# Altium project PCB_Project.PrjPcb
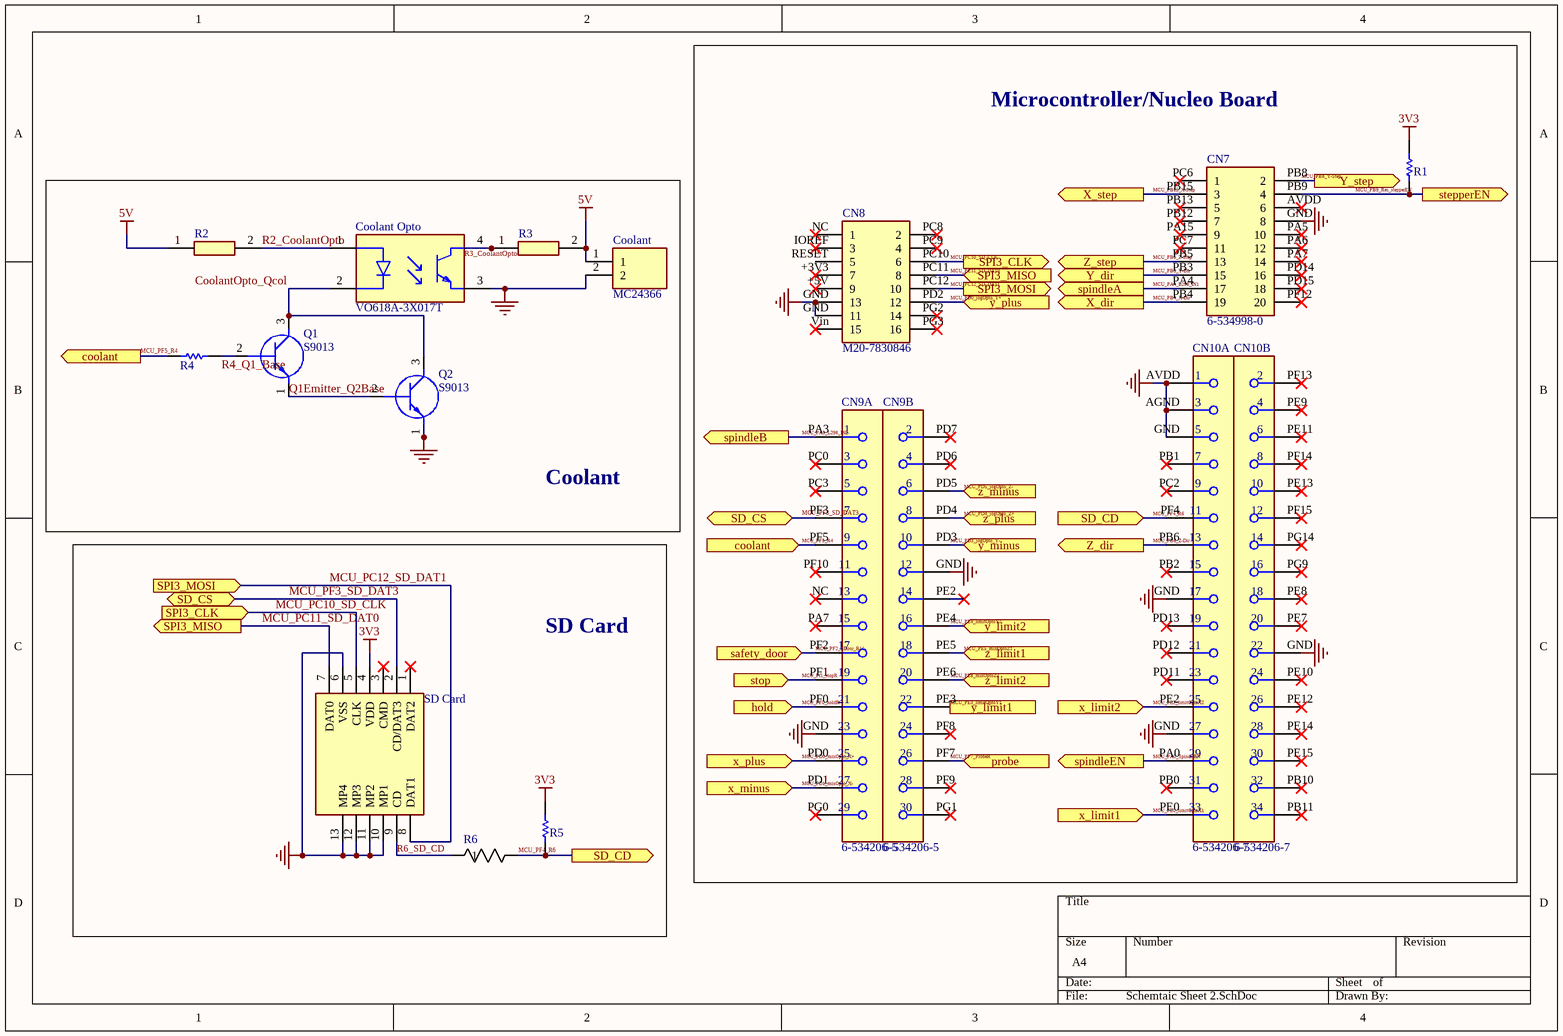
[diagram p0: Schemtaic Sheet 2.SchDoc]
3 sheets, 137 parts. Net scope: flat (ports and power ports of the same name join across sheets).
Board file: PCB.PcbDoc
Sheets:
  Schemtaic Sheet 2.SchDoc
  Schemtaic Sheet 4.SchDoc
  Schemtaic Sheet 3.SchDoc

## Sheet Schemtaic Sheet 2.SchDoc
size A4; SheetNumber: 1; SheetTotal: 3

### Parts
CN7  6-534998-0  [RHDR20W77P254X254_2X10_2540X503X673P]
CN8  M20-7830846  [RHDR16W70P254_2X8_2072X504X865P]
CN9  6-534206-5  [FP-6-534206-5-MFG]  (parts A,B of 2)
CN10  6-534206-7  [FP-6-534206-7-MFG]  (parts A,B of 2)
Coolant  MC24366  [Model Name]
Coolant_Opto  VO618A-3X017T  [FP-VO618A-3X017T-MFG]
Q1  S9013  [MJE13001TP]
Q2  S9013  [MJE13001TP]
R1  MFR-25FBF5210K  [RESA60-630X240]  (value not drawn)
R2  KNP100JB-73-75R  [RESAD2990W85L1150D460]  (value not drawn)
R3  MBB02070C9109FCT00  [RESAD1650W63L650D250]  (value not drawn)
R4  MFR-25FBF5210K  [RESA60-630X240]  (value not drawn)
R5  MFR-25FBF5210K  [RESA60-630X240]  (value not drawn)
R6  AC01000004700JA100  [RES_AC01_VIS]  (value not drawn)
SD_Card  MEM2075-00-140-01-A  [MEM20750014001A]  (value not drawn)

### Blocks framed on the sheet
Microcontroller/Nucleo Board: CN7-CN10 R1
Coolant: Coolant Coolant_Opto Q1 Q2 R2-R4
SD Card: R5 R6 SD_Card

### Ports
coolant (in, see Schemtaic Sheet 2[1B]), coolant (out, see Schemtaic Sheet 2[2C]), hold (in, see Schemtaic Sheet 4[3C]), probe (in, see Schemtaic Sheet 4[4A]), safety_door (in, see Schemtaic Sheet 4[3C]), SD_CD (in, see Schemtaic Sheet 2[2D]), SD_CD (out, see Schemtaic Sheet 2[3C]), SD_CS (bidir, see Schemtaic Sheet 2[1C]), SD_CS (bidir, see Schemtaic Sheet 2[2C]), SPI3_CLK (in, see Schemtaic Sheet 2[3B]), SPI3_CLK (out, see Schemtaic Sheet 2[1C]), SPI3_MISO (in, see Schemtaic Sheet 2[1C]), SPI3_MISO (out, see Schemtaic Sheet 2[3B]), SPI3_MOSI (in, see Schemtaic Sheet 2[3B]), SPI3_MOSI (out, see Schemtaic Sheet 2[1C]), spindleA (out, see Schemtaic Sheet 4[2C]), spindleB (out, see Schemtaic Sheet 4[2C]), spindleEN (out, see Schemtaic Sheet 4[2C]), stepperEN (out, see Schemtaic Sheet 4[1C], Schemtaic Sheet 4[2C]), stop (in, see Schemtaic Sheet 4[3B]), X_dir (out, see Schemtaic Sheet 4[1C]), x_limit1 (in, see Schemtaic Sheet 3[1D]), x_limit2 (in, see Schemtaic Sheet 3[1D]), x_minus (in, see Schemtaic Sheet 3[3D]), x_plus (in, see Schemtaic Sheet 3[3D]), X_step (out, see Schemtaic Sheet 4[1C]), Y_dir (out, see Schemtaic Sheet 4[1D]), y_limit1 (in, see Schemtaic Sheet 3[1D]), y_limit2 (in, see Schemtaic Sheet 3[1D]), y_minus (in, see Schemtaic Sheet 3[4D]), y_plus (in, see Schemtaic Sheet 3[4D]), Y_step (out, see Schemtaic Sheet 4[1D]), Z_dir (out, see Schemtaic Sheet 4[2C]), z_limit1 (in, see Schemtaic Sheet 3[3D]), z_limit2 (in, see Schemtaic Sheet 3[3D]), z_minus (in, see Schemtaic Sheet 3[4C]), z_plus (in, see Schemtaic Sheet 3[4D]), Z_step (out, see Schemtaic Sheet 4[2C])

### Nets
3V3: R1.2 R5.2 SD_Card.4(VDD)
5V: Coolant.1 R2.1 R3.2
GND: CN7.GND(8) CN8.GND(13) CN9.GND CN10.AGND CN10.AVDD CN10.GND Coolant.2 Coolant_Opto.3(E) Q2.1(E) SD_Card.6(VSS) SD_Card.10(MP1) SD_Card.11(MP2) SD_Card.12(MP3) SD_Card.13(MP4)
CoolantOpto_Qcol: Coolant_Opto.2(C) Q1.3(C) Q2.3(C)
MCU_PA0_SpindleEN: CN10.PA0 ; port spindleEN
MCU_PA3_L298_IN2: CN9.PA3 ; port spindleB
MCU_PA4_L298_IN1: CN7.PA4(17) ; port spindleA
MCU_PB3_Y-Dir: CN7.PB3(15) ; port Y_dir
MCU_PB4_X-Dir: CN7.PB4(19) ; port X_dir
MCU_PB5_Z-Step: CN7.PB5(13) ; port Z_step
MCU_PB6_Z-Dir: CN10.PB6 ; port Z_dir
MCU_PB8_Y-Step: CN7.PB8(2) ; port Y_step
MCU_PB9_Res_stepperEN: CN7.PB9(4) R1.1 ; port stepperEN
MCU_PB15_X-Step: CN7.PB15(3) ; port X_step
MCU_PC10_SD_CLK: CN8.PC10(6) SD_Card.5(CLK) ; port SPI3_CLK
MCU_PC11_SD_DAT0: CN8.PC11(8) SD_Card.7(DAT0) ; port SPI3_MISO
MCU_PC12_SD_DAT1: CN8.PC12(10) SD_Card.8(DAT1) ; port SPI3_MOSI
MCU_PD0_jogOpto_Y+: CN8.PD2(12) ; port y_plus
MCU_PD0_mixOpto_X+: CN9.PD0 ; port x_plus
MCU_PD1_mixOpto_X-: CN9.PD1 ; port x_minus
MCU_PD3_jogOpto_Y-: CN9.PD3 ; port y_minus
MCU_PD4_jogOpto_Z+: CN9.PD4 ; port z_plus  [project net MCU_PD3_jogOpto_Z+]
MCU_PD5_jogOpto_Z-: CN9.PD5 ; port z_minus  [project net MCU_PD0_jogOpto_Z-]
MCU_PE0_limitOptoX1: CN10.PE0 ; port x_limit1
MCU_PE2_limitOptoX2: CN10.PE2 ; port x_limit2
MCU_PE3_limitOptoY1: CN9.PE3 ; port y_limit1  [project net MCU_PE2_limitOptoY1]
MCU_PE4_limitOptoY2: CN9.PE4 ; port y_limit2  [project net MCU_PE0_limitOptoY2]
MCU_PE5_mixOptoZ1: CN9.PE5 ; port z_limit1  [project net MCU_PD1_mixOpto_Z1]
MCU_PE8_mixOptoZ2: CN9.PE6 ; port z_limit2  [project net MCU_PD0_mixOpto_Z2]
MCU_PF0_holdR: CN9.PF0 ; port hold
MCU_Pf1_stopR: CN9.PF1 ; port stop
MCU_PF2_SDoor_R11: CN9.PF2 ; port safety_door
MCU_PF3_SD_DAT3: CN9.PF3 SD_Card.2(CD/DAT3) ; port SD_CS
MCU_PF4_R6: CN10.PF4 R5.1 R6.2 ; port SD_CD
MCU_PF5_R4: CN9.PF5 R4.1 ; port coolant
MCU_PF7_ProbeR: CN9.PF7 ; port probe
Q1Emitter_Q2Base: Q1.1(E) Q2.2(B)
R2_CoolantOpto: Coolant_Opto.1(A) R2.2
R3_CoolantOpto: Coolant_Opto.4(C) R3.1
R4_Q1_Base: Q1.2(B) R4.2
R6_SD_CD: R6.1 SD_Card.9(CD)

Not connected (* = marked no-connect by the designer): CN7 AVDD(6)* PA5(10)* PA6(12)* PA7(14)* PA15(9)* PB12(7)* PB13(5)* PC6(1)* PC7(11)* PD14(16)* PD15(18)* PF12(20)*; CN8 +3V3(7)* +5V(9)* IOREF(3)* NC(1)* PC8(2)* PC9(4)* PG2(14)* PG3(16)* RESET(5) Vin(15)*; CN9 NC(13)* PA7(15)* PC0(3)* PC3(5)* PD6(4)* PD7(2)* PE2(14)* PF8(24)* PF9(28)* PF10(11)* PG0(29)* PG1(30)*; CN10 PB0(31)* PB1(7)* PB2(15)* PB10(32)* PB11(34)* PC2(9)* PD11(23)* PD12(21)* PD13(19)* PE7(20)* PE8(18)* PE9(4)* PE10(24)* PE11(6)* PE12(26)* PE13(10)* PE14(28)* PE15(30)* PF13(2)* PF14(8)* PF15(12)* PG9(16)* PG14(14)*; SD_Card 1(DAT2)* 3(CMD)*

### Library data of the parts
CN7 = 6-534998-0: Connector; Manufacturer_Name: TE Connectivity; Datasheet Link: http://www.te.com/commerce/DocumentDelivery/DDEController?Action=showdoc&DocId=Catalog+Section%7F1307819_SECTION_5%7F0908%7Fpdf%7FEnglish%7FENG_CS_1307819_SECTION_5_0908.pdf%7F6-534998-0; Height: 6.73mm; Manufacturer_Part_Number: 6-534998-0; Mouser Part Number: 571-6-534998-0; Mouser Price/Stock: https://www.mouser.co.uk/ProductDetail/TE-Connectivity/6-534998-0?qs=xDp7PGUNC%252BtlNIlh1MxdbQ%3D%3D; Arrow Part Number: 6-534998-0; Arrow Price/Stock: https://www.arrow.com/en/products/6-534998-0/te-connectivity
CN8 = M20-7830846: Connector; Manufacturer_Name: Harwin; Datasheet Link: https://cdn.harwin.com/pdfs/M20-783.pdf; Height: 8.65mm; Manufacturer_Part_Number: M20-7830846; Mouser Part Number: 855-M20-7830846; Mouser Price/Stock: https://www.mouser.co.uk/ProductDetail/Harwin/M20-7830846?qs=vF78I%252BjhbY9RWFQV7oNW%252BQ%3D%3D
CN9 = CMP-03369-000056-1: CONN RCPT 30POS 0.1 GOLD PCB; Manufacturer: TE; Number Of Contacts: 30; Is Female: yes; Pitch: 2.54mm; Conn Gender: Female; Standoff Height: 0.38mm; Conn Orientation: Vertical; Current Rating: 2A; Lead Free: Yes; Category: Conn; Mouser Description: Headers & Wire Housings REC 2X15P VRT T/H; Device Class L3: unset; Height: 8.9mm; ComponentLink2Description: Datasheet; Manufacturer Part Number: 6-534206-5; RoHS: TRUE; ComponentLink2URL: https://www.te.com/commerce/DocumentDelivery/DDEController?Action=showdoc&DocId=Specification+Or+Standard%7F114-25018%7FE%7Fpdf%7FEnglish%7FENG_SS_114-25018_E.pdf%7F6-534206-5; Temperature: -65°C to +105°C; Temperature Range Low: -65°C; Footprint Url: https://www.te.com/commerce/DocumentDelivery/DDEController?Action=showdoc&DocId=Customer+Drawing%7F534206%7FR7%7Fpdf%7FEnglish%7FENG_CD_534206_R7.pdf%7F6-534206-5; Contact Material: Gold,Nickel; Automotive: No; Package: 0; Device Class L2: Headers and Wire Housings; Device Class L1: Connectors; Temperature Range High: +105°C; Number Of Rows: 2; Digikey Description: CONN RCPT 30POS 0.1 GOLD PCB; Octopart: https://octopart.com/6-534206-5-te+connectivity-39516817
CN10 = CMP-03369-000075-1: CONN RCPT 34POS 0.1 GOLD PCB; Manufacturer: TE Connectivity; Pitch: 2.54mm; Number Of Contacts: 34; Standoff Height: 0.38mm; Conn Gender: Female; Conn Orientation: Vertical; Is Female: yes; Current Rating: 2A; Voltage Rating: 333V; Number Of Rows: 2; RoHS: TRUE; Lead Free: Yes; Contact Material: Gold,Nickel; Device Class L3: unset; Octopart: https://octopart.com/6-534206-7-te+connectivity-39516825; Automotive: No; Mouser Description: Headers & Wire Housings REC 2X17P VRT T/H; Temperature Range Low: -65°C; Device Class L1: Connectors; Footprint Url: https://www.te.com/commerce/DocumentDelivery/DDEController?Action=showdoc&DocId=Customer+Drawing%7F534206%7FR7%7Fpdf%7FEnglish%7FENG_CD_534206_R7.pdf%7F6-534206-7; ComponentLink2URL: https://www.te.com/commerce/DocumentDelivery/DDEController?Action=showdoc&DocId=Specification+Or+Standard%7F114-25018%7FE%7Fpdf%7FEnglish%7FENG_SS_114-25018_E.pdf%7F6-534206-7; Temperature: -65°C to +105°C; Device Class L2: Headers and Wire Housings; Height: 8.9mm; Temperature Range High: +105°C; Digikey Description: CONN RCPT 34POS 0.1 GOLD PCB; Manufacturer Part Number: 6-534206-7; Category: Conn; Package: 6-534206-7; ComponentLink2Description: Datasheet
Coolant = MC24366: TERMINAL BLOCK, WIRE TO BRD, 2POS, 12AWG; Manufacturer_Name: MULTICOMP; Geometry.Height: 14.3mm; Manufacturer_Part_Number: MC24366; Mouser Part Number: *; Mouser Price/Stock: *; Arrow Part Number: *; Arrow Price/Stock: *; Datasheet Link: *
Coolant_Opto = CMP-02521-000022-1: OPTOISOLATOR 5.3KV TRANS 4-SMD; Max Power Dissipation: 150mW; Collector-emitter Voltage-Max: 400mV; Number of Elements: 1; Forward Voltage: 1.1V; Max Collector Current: 50mA; Collector Emitter Voltage (VCEO): 80V; Current Transfer Ratio: 100%; Forward Current: 60mA; Reverse Breakdown Voltage: 6V; Input Type: DC; Series: -; Mount: Surface Mount; Isolation Voltage: 5.3kV; Contact Plating: Tin; Max Output Voltage: 80V; Package Quantity: 1; RoHS Compliant: Yes; Min Operating Temperature: -55°C; Power Dissipation: 150mW; Max Operating Temperature: 110°C; Radiation Hardening: No; Packaging: Tape and Reel; Max Input Current: 60mA; Output Current per Channel: 50mA; Number of Pins: 4; Case/Package: SMD/SMT; Number of Channels: 1; Lead Free: Lead Free; Collector Emitter Saturation Voltage: 400mV; Input Current: 60mA
Q1 Q2 = S9013: Transistor BJT NPN; Manufacturer_Name: MCC; Datasheet Link: https://datasheet.datasheetarchive.com/originals/distributors/Datasheets-19/DSA-361984.pdf; Height: 6.5mm; Manufacturer_Part_Number: S9013
R1 R4 R5 = CMP-1659-00074-2: Axial Resistor, 10 KOhm, +/- 1%, 0.25 W, -55 to 155 degC, 2-Pin THD, RoHS, Bulk; Manufacturer: Yageo; Temperature Coefficient: 100ppm\/degreesC; Voltage Rating: 250V; Voltage Rating (DC): 200V; Resistance: 10KOhm; Max Power Dissipation: 250mW; Datasheet URL: http://www.yageo.com/documents/recent/Yageo%20LR_MFR_2013.pdf; Packaging: Bulk; RoHSCompliant: True; Mount: ThroughHole; Package Reference: MFR-25; Termination: Axial; Composition: MetalFilm; Number of Terminations: 2; Package Quantity: 200; Mounting Technology: ThroughHole; Length: 0.248inch; Max Operating Temperature: 155degC; Min Operating Temperature: -55degC; Datasheet Version: 04/2013; Lead Free: LeadFree; Manufacturer URL: http://www.yageo.com/; Tolerance: 1%; Power Rating: 250mW; Package Description: 2-Pin Axial Lead, Dia 2.4 mm, Body Length 6.3 mm; Military Standard: Not; Case\/Package: Axial
R2 = KNP100JB-73-75R: Resistor; Manufacturer_Name: YAGEO; Datasheet Link: https://www.arrow.com/en/products/knp100jb-73-75r/yageo?region=nac; Manufacturer_Part_Number: KNP100JB-73-75R
R3 = MBB02070C9109FCT00: Resistor; Manufacturer_Name: Vishay; Datasheet Link: https://www.vishay.com/docs/28766/mbxsma.pdf; Manufacturer_Part_Number: MBB02070C9109FCT00
R6 = CMP-00030-42521877-1: AC01000004700JA100 VISHAY AC01000004700JA100 Through Hole Resistor, 470 ohm, Axial Leaded, 1 W, 5%, AC Series; Temperature Coefficient: 180ppm/°C; Voltage Rating (DC): 22V; Max Power Dissipation: 1W; Resistance: 470Ω; Lead Diameter: 800µm; Max Operating Temperature: 200°C; Number of Pins: 2; Weight: 519.986953mg; Contact Plating: Tin; Radiation Hardening: No; Number of Terminations: 2; Military Standard: Not; REACH SVHC: Unknown; Packaging: Cut Tape (CT); Tolerance: 5%; Composition: Wirewound; NexarPartId: 42521877; Case/Package: Conformal; Termination: Axial; Power Rating: 1W; RoHS: Compliant; Length: 11mm; Min Operating Temperature: 0°C; Diameter: 4.3mm
SD_Card = MEM2075-00-140-01-A: Connector; Manufacturer_Name: GCT (GLOBAL CONNECTOR TECHNOLOGY); Datasheet Link: http://www.farnell.com/cad/2606866.pdf; Manufacturer_Part_Number: MEM2075-00-140-01-A; Mouser Part Number: 640-MEM20750014001A; Mouser Price/Stock: https://www.mouser.co.uk/ProductDetail/GCT/MEM2075-00-140-01-A?qs=KUoIvG%2F9IlZvfWpeERlq3Q%3D%3D

## Sheet Schemtaic Sheet 4.SchDoc
size A4; SheetNumber: 2; SheetTotal: 3
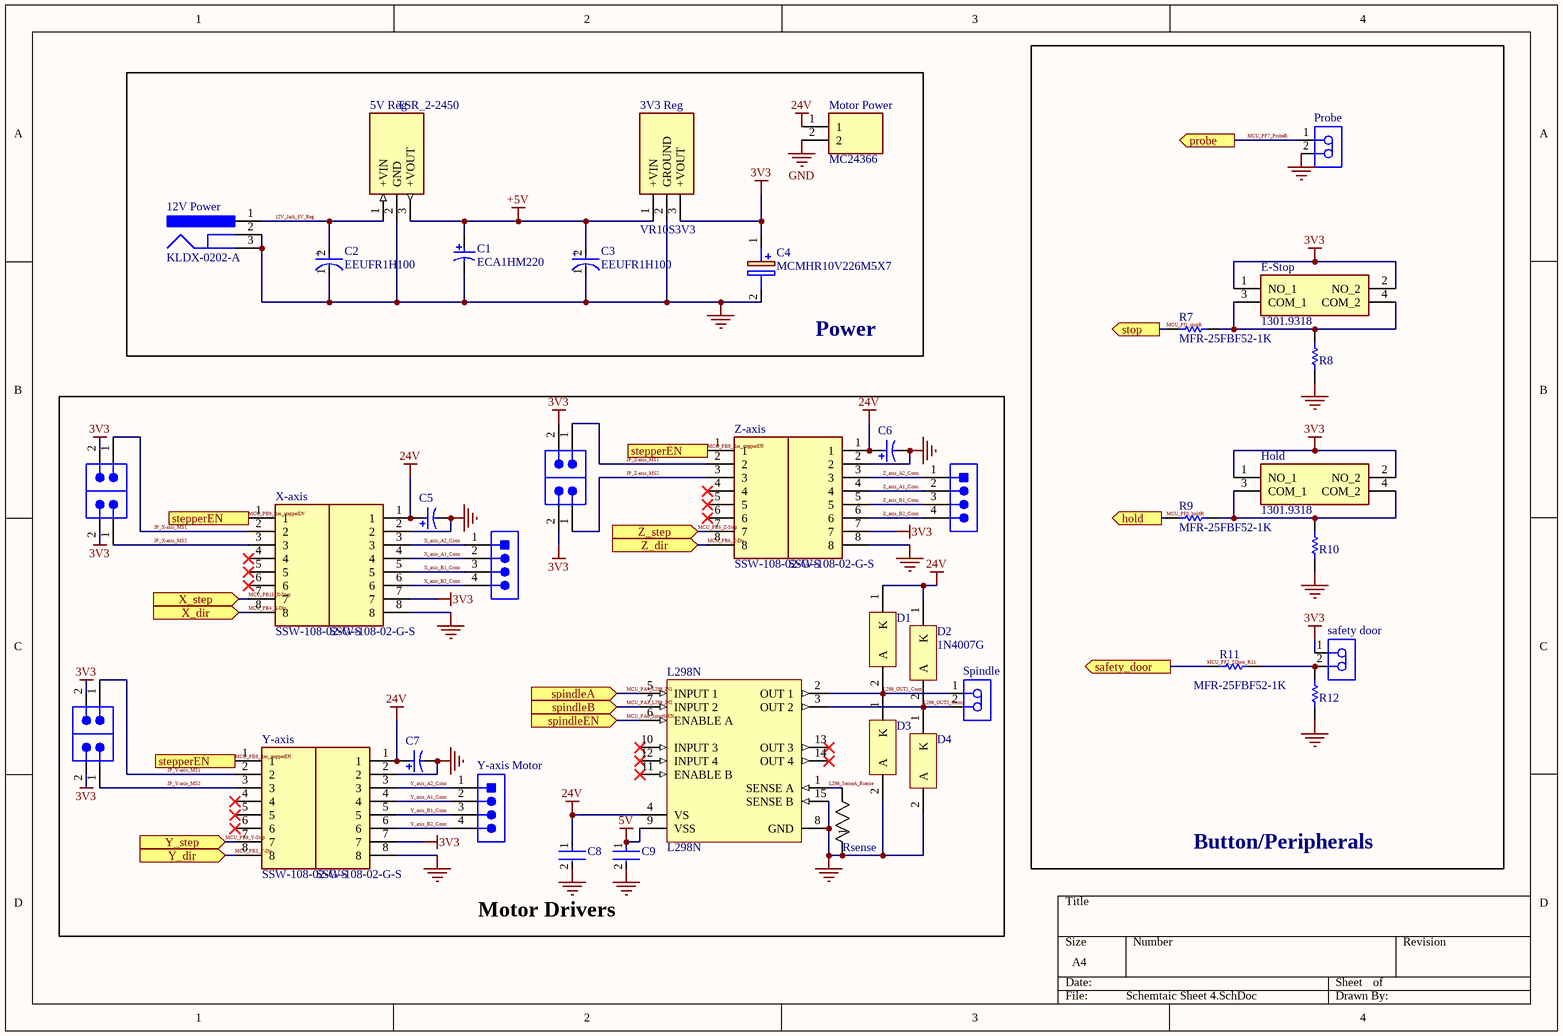
[diagram p1: Schemtaic Sheet 4.SchDoc]

### Parts
3V3_Reg  VR10S3V3  [VR10S3V3]
5V_Reg  TSR_2-2450  [TSR-2]
12V_Power  KLDX-0202-A  [KYCN-KLDX-0202-A_V]
C1  ECA1HM220  [CAPPR55-200-1100X500X1200]
C2  EEUFR1H100  [FP-RAD-TH-D_5_0_5-L_11_1-MFG]
C3  EEUFR1H100  [FP-RAD-TH-D_5_0_5-L_11_1-MFG]
C4  MCMHR10V226M5X7  [CAPPRD200W47D525H800]
C5  ECA1HM101  [CAPPR65-350-1150X800X1250]  (value not drawn)
C6  ECA1HM101  [CAPPR65-350-1150X800X1250]  (value not drawn)
C7  ECA1HM101  [CAPPR65-350-1150X800X1250]  (value not drawn)
C8  K104K15X7RF5TH5  [FP-K15H5-MFG]  (value not drawn)
C9  K104K15X7RF5TH5  [FP-K15H5-MFG]  (value not drawn)
D1  1N4007G  [ONSC-AXIAL_LEAD-2-59-10_P]  (value not drawn)
D2  1N4007G  [ONSC-AXIAL_LEAD-2-59-10_P]
D3  1N4007G  [ONSC-AXIAL_LEAD-2-59-10_P]  (value not drawn)
D4  1N4007G  [ONSC-AXIAL_LEAD-2-59-10_P]  (value not drawn)
E-Stop  1301.9318  [13019318]
Hold  1301.9318  [13019318]
L298N  L298N  [STM-FM-15]
Motor_Power  MC24366  [MC24366]
Probe  B2B-PH-K-S(LF)(SN)  [JST-B2B-PH-K-S_V]  (value not drawn)
R7  MFR-25FBF52-1K  [RESA60-630X240]
R8  MFR-25FBF5210K  [RESA60-630X240]  (value not drawn)
R9  MFR-25FBF52-1K  [RESA60-630X240]
R10  MFR-25FBF5210K  [RESA60-630X240]  (value not drawn)
R11  MFR-25FBF52-1K  [RESA60-630X240]
R12  MFR-25FBF5210K  [RESA60-630X240]  (value not drawn)
Rsense  AC05000001508JAC00  [RES_AC05_VIS]  (value not drawn)
safety_door  B2B-PH-K-S(LF)(SN)  [JST-B2B-PH-K-S_V]  (value not drawn)
Spindle  B2B-PH-K-S(LF)(SN)  [JST-B2B-PH-K-S_V]  (value not drawn)
X-axis  SSW-108-02-G-S  [RHDR8W79P0X254_1X8_2083X241X851P]
X-axis_Header_R  SSW-108-02-G-S  [RHDR8W79P0X254_1X8_2083X241X851P]
X-axis_Motor  B4B-EH-A(LF)(SN)  [JST-B4B-EH-A_V]  (value not drawn)
X-MS1  61300211121  [61300211121]  (value not drawn)
X-MS2  61300211121  [61300211121]  (value not drawn)
Y-axis  SSW-108-02-G-S  [RHDR8W79P0X254_1X8_2083X241X851P]
Y-axis_Header_R  SSW-108-02-G-S  [RHDR8W79P0X254_1X8_2083X241X851P]
Y-axis_Motor  B4B-EH-A(LF)(SN)  [JST-B4B-EH-A_V]  (value not drawn)
Y-MS1  61300211121  [61300211121]  (value not drawn)
Y-MS2  61300211121  [61300211121]  (value not drawn)
Z-axis  SSW-108-02-G-S  [RHDR8W79P0X254_1X8_2083X241X851P]
Z-axis_Header_R  SSW-108-02-G-S  [RHDR8W79P0X254_1X8_2083X241X851P]
Z-axis_Motor  B4B-EH-A(LF)(SN)  [JST-B4B-EH-A_V]  (value not drawn)
Z-MS1  61300211121  [61300211121]  (value not drawn)
Z-MS2  61300211121  [61300211121]  (value not drawn)

### Blocks framed on the sheet
Power: 3V3_Reg 5V_Reg 12V_Power C1-C4 Motor_Power
Button/Peripherals: E-Stop Hold Probe R7-R12 safety_door

### Ports
hold (out, see Schemtaic Sheet 2[2C]), probe (out, see Schemtaic Sheet 2[3C]), safety_door (out, see Schemtaic Sheet 2[2C]), spindleA (in, see Schemtaic Sheet 2[3B]), spindleB (in, see Schemtaic Sheet 2[2B]), spindleEN (in, see Schemtaic Sheet 2[3C]), stepperEN (out, see Schemtaic Sheet 2[4A], Schemtaic Sheet 4[1C]), stepperEN (out, see Schemtaic Sheet 2[4A], Schemtaic Sheet 4[1C], Schemtaic Sheet 4[2B]), stop (out, see Schemtaic Sheet 2[2C]), X_dir (in, see Schemtaic Sheet 2[3B]), X_step (in, see Schemtaic Sheet 2[3A]), Y_dir (in, see Schemtaic Sheet 2[3B]), Y_step (in, see Schemtaic Sheet 2[4A]), Z_dir (in, see Schemtaic Sheet 2[3C]), Z_step (in, see Schemtaic Sheet 2[3B])

### Nets
3V3: 3V3_Reg.3(+VOUT) C4.1(+) E-Stop.1(NO_1) E-Stop.2(NO_2) Hold.1(NO_1) Hold.2(NO_2) safety_door.1 X-axis_Header_R.7 X-MS1.2 X-MS2.2 Y-axis_Header_R.7 Y-MS1.2 Y-MS2.2 Z-axis_Header_R.7 Z-MS1.2 Z-MS2.2
5V: C9.1 L298N.9(VSS)
24V: C5.1 C6.1 C7.1 C8.1 D1.1(K) D2.1(K) L298N.4(VS) Motor_Power.1 X-axis_Header_R.1 Y-axis_Header_R.1 Z-axis_Header_R.1
+5V: 3V3_Reg.1(+VIN) 5V_Reg.3(+VOUT) C1.1 C3.2(A)
GND: 3V3_Reg.2(GROUND) 5V_Reg.2(GND) 12V_Power.2 12V_Power.3 C1.2 C2.1(C) C3.1(C) C4.2(-) C5.2 C6.2 C7.2 C8.2 C9.2 D3.2(A) D4.2(A) L298N.8(GND) L298N.15(SENSE_B) Motor_Power.2 Probe.2 R8.1 R10.1 R12.1 Rsense.1 X-axis_Header_R.2 X-axis_Header_R.8 Y-axis_Header_R.2 Y-axis_Header_R.8 Z-axis_Header_R.2 Z-axis_Header_R.8
12V_Jack_5V_Reg: 5V_Reg.1(+VIN) 12V_Power.1 C2.2(A)
JP_X-axis_MS1: X-axis.2 X-MS1.1
JP_X-axis_MS2: X-axis.3 X-MS2.1
JP_Y-axis_MS1: Y-axis.2 Y-MS1.1
JP_Y-axis_MS2: Y-axis.3 Y-MS2.1
JP_Z-axis_MS1: Z-axis.2 Z-MS1.1
JP_Z-axis_MS2: Z-axis.3 Z-MS2.1
L298_OUT1_Conn: D1.2(A) D3.1(K) L298N.2(OUT_1) Spindle.1
L298_OUT2_Conn: D2.2(A) D4.1(K) L298N.3(OUT_2) Spindle.2
L298_SenseA_Rsense: L298N.1(SENSE_A) Rsense.2
MCU_PA0_SpindleEN: L298N.6(ENABLE_A) ; port spindleEN
MCU_PA3_L298_IN2: L298N.7(INPUT_2) ; port spindleB
MCU_PA4_L298_IN1: L298N.5(INPUT_1) ; port spindleA
MCU_PB3_Y-Dir: Y-axis.8 ; port Y_dir
MCU_PB4_X-Dir: X-axis.8 ; port X_dir
MCU_PB5_Z-Step: Z-axis.7 ; port Z_step
MCU_PB6_Z-Dir: Z-axis.8 ; port Z_dir
MCU_PB8_Y-Step: Y-axis.7 ; port Y_step
MCU_PB9_Res_stepperEN: X-axis.1 Y-axis.1 Z-axis.1 ; port stepperEN
MCU_PB15_X-Step: X-axis.7 ; port X_step
MCU_PF0_holdR: R9.1 ; port hold
MCU_Pf1_stopR: R7.1 ; port stop
MCU_PF2_SDoor_R11: R11.1 ; port safety_door
MCU_PF7_ProbeR: Probe.1 ; port probe
X_axis_A1_Conn: X-axis_Header_R.4 X-axis_Motor.2
X_axis_A2_Conn: X-axis_Header_R.3 X-axis_Motor.1
X_axis_B1_Conn: X-axis_Header_R.5 X-axis_Motor.3
X_axis_B2_Conn: X-axis_Header_R.6 X-axis_Motor.4
Y_axis_A1_Conn: Y-axis_Header_R.4 Y-axis_Motor.2
Y_axis_A2_Conn: Y-axis_Header_R.3 Y-axis_Motor.1
Y_axis_B1_Conn: Y-axis_Header_R.5 Y-axis_Motor.3
Y_axis_B2_Conn: Y-axis_Header_R.6 Y-axis_Motor.4
Z_axis_A1_Conn: Z-axis_Header_R.4 Z-axis_Motor.2
Z_axis_A2_Conn: Z-axis_Header_R.3 Z-axis_Motor.1
Z_axis_B1_Conn: Z-axis_Header_R.5 Z-axis_Motor.3
Z_axis_B2_Conn: Z-axis_Header_R.6 Z-axis_Motor.4
NetE-Stop_3: E-Stop.3(COM_1) E-Stop.4(COM_2) R7.2 R8.2
NetHold_3: Hold.3(COM_1) Hold.4(COM_2) R9.2 R10.2
NetR11_2: R11.2 R12.2 safety_door.2

Not connected (* = marked no-connect by the designer): L298N 10(INPUT_3)* 11(ENABLE_B)* 12(INPUT_4)* 13(OUT_3)* 14(OUT_4)*; X-axis 4* 5* 6*; Y-axis 4* 5* 6*; Z-axis 4* 5* 6*

### Notes on the sheet
- Motor Drivers
- (in symbol CMP-05427-001295-1) +

### Library data of the parts
3V3_Reg = VR10S3V3: Power Supply; Manufacturer_Name: XP POWER; Datasheet Link: https://www.xppower.com/portals/0/pdfs/SF_VR10.pdf; Height: 10.9mm; Manufacturer_Part_Number: VR10S3V3; Mouser Part Number: 209-VR10S3V3; Mouser Price/Stock: https://www.mouser.co.uk/ProductDetail/XP-Power/VR10S3V3?qs=7MVldsJ5UazpqISEyvrTNQ%3D%3D
5V_Reg = TSR_2-2450: Power Supply; Manufacturer_Name: Traco Power; Manufacturer_Part_Number: TSR 2-2450; Datasheet Link: https://tracopower.com/tsr2-datasheet/; Mouser Part Number: 495-TSR2-2450; Mouser Price/Stock: https://www.mouser.co.uk/ProductDetail/TRACO-Power/TSR-2-2450?qs=NtE2QagKf6RzknAolzm%2FTQ%3D%3D; Arrow Part Number: TSR 2-2450; Arrow Price/Stock: https://www.arrow.com/en/products/tsr2-2450/traco-electronic-ag?region=europe
12V_Power = CMP-1673-00001-5: DC Power Jack, 24 V, 3.5 A, -25 to 85 degC, 3-Pin THD, RoHS; Manufacturer: Kycon; Voltage Rating: 24 V; Current Rating: 3.5 A; Height: 10.8 mm; Length: 9.2 mm; Pins: 2; Housing Material: PBT; Connector Type: Power; ComponentLink2URL: http://www.kycon.com/Pub_Eng_Draw/KLDX-0202-X.PDF; PackageDescription: 3-Pin Through Hole Device, Body 14.5 x 9 mm; Max Operating Temperature: 85 degC; Min Operating Temperature: -25 degC; PackageReference: KLDX-0202-A; Contact Gender: Female; Package Quantity: 500; Mount: Through Hole; Colour: Black; Contact Plating: Tin; DatasheetVersion: Rev. D3, 06/2013; ComponentLink2Description: Datasheet; RoHSCompliant: true; Mounting Technology: Through Hole; ComponentLink1Description: Manufacturer URL; Contact Material: Brass; ComponentLink1URL: http://www.kycon.com/
C1 = CMP-1665-00036-2: Aluminum Electrolytic Capacitor, 22 uF, +/- 20%, 50 V, -40 to 85 degC, 2-Pin THD, RoHS, Bulk; Manufacturer: Panasonic; Ripple Current: 100mA; Life (Hours): 2000Hour; Voltage: 50V; Dissipation Factor: 0.12%; Leakage Current: 3uA; Lead/Base Style: Straight; Capacitance: 22uF; Lead Diameter: 0.5mm; Max Operating Temperature: 85degC; Height: 11mm; Package Reference: CAPPR55-200-1100X500X1200; Radiation Hardening: No; RoHSCompliant: true; Termination: Radial; Case/Package: Radial; REACH SVHC: NoSVHC; Height - Seated (Max): 0.472inch; Min Operating Temperature: -40degC; Packaging: Bulk; Manufacturer URL: http://www.panasonic.com/; Length: 11mm; Tolerance: 20%; Voltage Rating: 50V; Voltage Rating (DC): 50V; Datasheet URL: https://industrial.panasonic.com/cdbs/www-data/pdf/RDF0000/ABA0000C1218.pdf; Lead Pitch: 2mm; Ripple Current (AC): 100mA; Package Description: 2-Pin Radial Lead, Dia 5 mm, Height 12 mm; Diameter: 5mm; Datasheet Version: Rev. 05, 10/2016; Package Quantity: 200; Mount: ThroughHole
C2 C3 = CMP-05427-001295-1: Aluminum Electrolytic Capacitors (Radial Lead Type) 10uF ±20% 50V; Lead Diameter: 0.5mm; Life (Hours): 5000Hour; Impedance: 340mR; Ripple Current (AC): 250mA; REACH SVHC: Yes; Tolerance: 20%; Construction: RADIAL; Min Operating Temperature: -40°C; Termination: Radial; Voltage Rating: 50V; Height: 11mm; Max Operating Temperature: 105°C; Capacitance: 10uF; Voltage: 50V; Diameter: 5mm; Lead Pitch: 2mm; Series: FR Radial; RoHS Compliant: Yes; Case/Package: Radial
C4 = MCMHR10V226M5X7: Capacitor Polarised; Manufacturer_Name: Multicomp Pro; Datasheet Link: https://componentsearchengine.com/Datasheets/2/MCMHR10V226M5X7.pdf; Height: 8mm; Manufacturer_Part_Number: MCMHR10V226M5X7
C5-C7 = CMP-1665-00042-2: Aluminum Electrolytic Capacitor, 100 uF, +/- 20%, 50 V, -40 to 85 degC, 2-Pin THD, RoHS, Bulk; Manufacturer: Panasonic; Lead Diameter: 0.6mm; Dielectric Material: Aluminium; Voltage Rating (DC): 50V; Ripple Current (AC): 250mA; Polarity: Polar; Leakage Current: 3uA; Capacitance: 100uF; Life (Hours): 2000Hour; Lead/Base Style: Straight; Dissipation Factor: 0.12%; Radiation Hardening: No; Height: 11.5mm; Package Quantity: 200; Package Reference: CAPPR65-350-1150X800X1250; Min Operating Temperature: -40degC; Mount: ThroughHole; Package Description: 2-Pin Radial Lead, Dia 8 mm, Height 12.5 mm; Case/Package: Radial; Diameter: 8mm; Voltage Rating: 50V; Length: 11.5mm; REACH SVHC: NoSVHC; Height - Seated (Max): 0.492inch; Datasheet URL: https://industrial.panasonic.com/cdbs/www-data/pdf/RDF0000/ABA0000C1218.pdf; RoHSCompliant: true; Ripple Current: 250mA; Lead Free: LeadFree; Voltage: 50V; Manufacturer URL: http://www.panasonic.com/; Number of Pins: 2; Datasheet Version: Rev. 05, 10/2016; Packaging: Bulk; Termination: Radial; Max Operating Temperature: 85degC; Tolerance: 20%; Lead Pitch: 3.5mm
C8 C9 = CMP-02417-000078-1: CAP CER 0.1UF 50V X7R RADIAL; Capacitance: 100nF; Tolerance: 10%; Dielectric Material: Ceramic; Lead Length: 30mm; Lead Diameter: 0.5mm; Lead/Base Style: Formed Leads; Diameter: 500um; Max Operating Temperature: 125°C; Case/Package: Dipped; Dielectric: X7R; Lead Free: Lead Free; Construction: RADIAL; Voltage: 50V; Thickness: 2.6mm; Min Operating Temperature: -55°C; Lead Pitch: 5mm; Height: 4mm; Radiation Hardening: No; Voltage Rating: 50V; Depth: 2.5mm; Voltage Rating (DC): 50V; Package Quantity: 1; Weight: 0.005644oz; Series: K; Mount: Through Hole; Termination: Radial; Height - Seated (Max): 0.257inch; Length: 4mm; Packaging: Tape and Reel; Width: 2.5mm; RoHS Compliant: Yes
D1-D4 = CMP-0902-00143-1: Standard Recovery Rectifier, 2-Pin Axial_Lead, Pb-Free, Bulk Bag; Manufacturer: On Semiconductor; VRRM Max (V): 1000; IFSM Max (A): 30; IO(rec) Max (A): 1; ComponentLink2Description: Datasheet; ComponentLink2URL: http://www.onsemi.com/pub_link/Collateral/1N4001-D.PDF; PackageDescription: 2-Pin, Axial Lead, Diameter 2.35 mm; PartNumber: 1N4007G; ComponentLink1URL: http://www.onsemi.com/; ComponentLink3URL: http://www.onsemi.cn/pub_link/Collateral/59-10.PDF; PackageReference: AXIAL_LEAD-2-59-10; ComponentLink1Description: Manufacturer URL; Mounting Technology: Through Hole; ComponentLink3Description: Package Specification; Packing: Bulk Bag; PackageVersion: Rev. U, 02/2005; DatasheetVersion: Rev. 13; RoHS: TRUE; Type: Standard Recovery
E-Stop Hold = 1301.9318: IP40 Black Button Tactile Switch, SPST-NO 4.4mm; Manufacturer_Name: SCHURTER; Geometry.Height: 8mm; Manufacturer_Part_Number: 1301.9318; Mouser Part Number: 693-1301.9318; Mouser Price/Stock: https://www.mouser.co.uk/ProductDetail/Schurter/13019318?qs=tGaZrb6HVSaxYojxkk2y5w%3D%3D; Arrow Part Number: *; Arrow Price/Stock: *; Datasheet Link: https://componentsearchengine.com/Datasheets/2/1301.9318.pdf
L298N = CMP-2000-06526-1: Dual Full-Bridge Driver, 4.8 to 46 V, -40 to 150 degC, 15-Pin FM (MW 15L), RoHS, Tube; Manufacturer: STMicroelectronics; PartNumber: L298; Output Current: 2A; Supply Voltage Max: 7V; Driver Case Style: Multiwatt; Supply Voltage Min: 4.5V; No. of Pins: 15Pins; SVHC: NoSVHC(17-Dec-2015); Output Voltage: 46V; No. of Outputs: 4Outputs; Motor Type: FullBridge; MSL: -; Package Description: 15-Pin Flange Mount, Body 5 x 19.6 mm, Pitch 1.27 mm; Datasheet Version: 01/2000; Package Reference: FM-15; Mounting Technology: ThroughHole; Packaging: Each; Automotive Qualification Standard: -; Product Range: -; Datasheet URL: https://datasheet.ciiva.com/15109/getdatasheetpartid-50682-15109332.pdf; Operating Temperature Max: 130°C; Operating Temperature Min: -25°C; Manufacturer URL: http://www.st.com/
Motor_Power = MC24366: as Coolant on sheet Schemtaic Sheet 2; Manufacturer_Part_Number: MC24366; Mouser Part Number: *; Mouser Price/Stock: *; Arrow Part Number: *; Arrow Price/Stock: *; Datasheet Link: *
Probe safety_door Spindle = CMP-2000-05162-1: Male Header, Pitch 2 mm, 1 x 2 Position, Height 6 mm, Tail Length 3.4 mm, -25 to 85 degC, RoHS, Bulk; Manufacturer: JST; Pitch: 2mm; Style/Orientation: StraightHeader/Plug; No of Positions: 2; Datasheet Version: Nov-08; Datasheet URL: http://datasheet.octopart.com/B2B-PH-K-S%28LF%29%28SN%29-JST-datasheet-8324864.pdf; Manufacturer URL: http://www.jst.com/home2.html; Type: ShroudedHeader; Termination: Crimp
R7 R9 R11 = CMP-1659-00075-1: Axial Resistor, 1 KOhm, +/- 1%, 250 mW, -55 to 155 degC, 2-Pin THD, RoHS, Bulk; Voltage Rating: 250 V; Resistance: 10 kohm; Power Rating: 250 mW; ComponentLink2Description: Datasheet; RoHSCompliant: true; PackageReference: MFR-25; Case\Package: Axial; Max Operating Temperature: 155 degC; DatasheetVersion: Apr-13; Tolerance: 1%; ComponentLink1URL: http://www.yageo.com/; Length: 0.248 inch; ComponentLink2URL: http://www.yageo.com/documents/recent/Yageo%20LR_MFR_2013.pdf; Packaging: Bulk; Package Quantity: 200; PackageDescription: 2-Pin Axial Lead, Dia 2.4 mm, Body Length 6.3 mm; Min Operating Temperature: -55 degC; ComponentLink1Description: Manufacturer URL
R8 R10 R12 = CMP-1659-00074-2: as R1 on sheet Schemtaic Sheet 2; Datasheet URL: http://www.yageo.com/documents/recent/Yageo%20LR_MFR_2013.pdf; Packaging: Bulk; RoHSCompliant: True; Mount: ThroughHole; Package Reference: MFR-25; Termination: Axial; Composition: MetalFilm; Number of Terminations: 2; Package Quantity: 200; Mounting Technology: ThroughHole; Length: 0.248inch; Max Operating Temperature: 155degC; Min Operating Temperature: -55degC; Datasheet Version: 04/2013; Lead Free: LeadFree; Manufacturer URL: http://www.yageo.com/; Tolerance: 1%; Power Rating: 250mW; Package Description: 2-Pin Axial Lead, Dia 2.4 mm, Body Length 6.3 mm; Military Standard: Not; Case\/Package: Axial
Rsense = CMP-00030-39746773-1: AC05000001508JAC00 Resistor, 1.5 Ohm, ± 5%, 5 W, Axial Leaded, Wirewound, General Purpose; Voltage Rating: 3V; Power Rating: 5W; Resistance: 1.5Ω; Lead Diameter: 800µm; Temperature Coefficient: -80ppm/°C; RoHS: Compliant; Weight: 1.900013g; Voltage Rating (DC): 3V; Max Operating Temperature: 275°C; NexarPartId: 39746773; Features: Flame Retardant Coating; Number of Pins: 2; REACH SVHC: Unknown; Contact Plating: Tin; Min Operating Temperature: -40°C; Width: 7.493mm; Radiation Hardening: No; Number of Terminations: 2; Diameter: 7.5mm; Termination: Axial; Composition: Wirewound; Max Power Dissipation: 5W; Packaging: Tape & Box (TB); Length: 18mm; Tolerance: 5%; Case/Package: Axial; Military Standard: Not
X-axis X-axis_Header_R Y-axis Y-axis_Header_R Z-axis Z-axis_Header_R = SSW-108-02-G-S: Connector; Manufacturer_Name: SAMTEC; Datasheet Link: https://componentsearchengine.com/Datasheets/1/SSW-108-02-G-S-LL.pdf; Height: 8.51mm; Manufacturer_Part_Number: SSW-108-02-G-S; Mouser Part Number: 200-SSW10802GS; Mouser Price/Stock: https://www.mouser.co.uk/ProductDetail/Samtec/SSW-108-02-G-S?qs=rU5fayqh%252BE1JXJ1Fey24nA%3D%3D; Arrow Part Number: SSW-108-02-G-S; Arrow Price/Stock: https://www.arrow.com/en/products/ssw-108-02-g-s/samtec?region=nac
X-axis_Motor Y-axis_Motor Z-axis_Motor = CMP-2000-05904-1: Male Header, Pitch 2.5 mm, 1 x 4 Position, Height 6 mm, Tail Length 3.2 mm, -25 to 85 degC, RoHS, Bulk; Manufacturer: JST; Style/Orientation: StraightHeader/Plug; Pitch: 2.5mm; No of Positions: 4; Mounting Technology: SurfaceMount; Package Description: Male Header, Pitch 2.5 mm, 1 x 4 Position, Height 6 mm, Tail Length 3.2 mm; Datasheet Version: 12/2012; Type: ShroudedHeader; Package Reference: B4B-EH-A; Manufacturer URL: http://www.jst.com/home2.html; Termination: Crimp; Datasheet URL: http://www.jst-mfg.com/product/pdf/eng/eEH.pdf
X-MS1 X-MS2 Y-MS1 Y-MS2 Z-MS1 Z-MS2 = CMP-1712-00002-5: NexarPartId: 20081794; Operating Supply Voltage: 250V; Current Rating: 3A; Gender: Male; Number of Contacts: 2; Pitch: 2.54mm; Connector Type: Male Pin; Contact Resistance: 20mΩ; Contact Plating: Gold; Contact Material: Copper; Number of Pins: 2; Min Operating Temperature: -40°C; Packaging: Bulk; Lead Pitch: 2.54mm; Mount: Through Hole; Orientation: Vertical; RoHS: Compliant; REACH SVHC: No SVHC; Height: 8.94mm; Termination: Through Hole; Number of Positions: 2; Contact Mating Length: 5.9944mm; Color: Black; Contact Gender: Male; Number of Rows: 1; Housing Material: PBT; Lead Free: Lead Free; Voltage Rating: 250V; Max Operating Temperature: 125°C

## Sheet Schemtaic Sheet 3.SchDoc
size A4; SheetNumber: 3; SheetTotal: 3
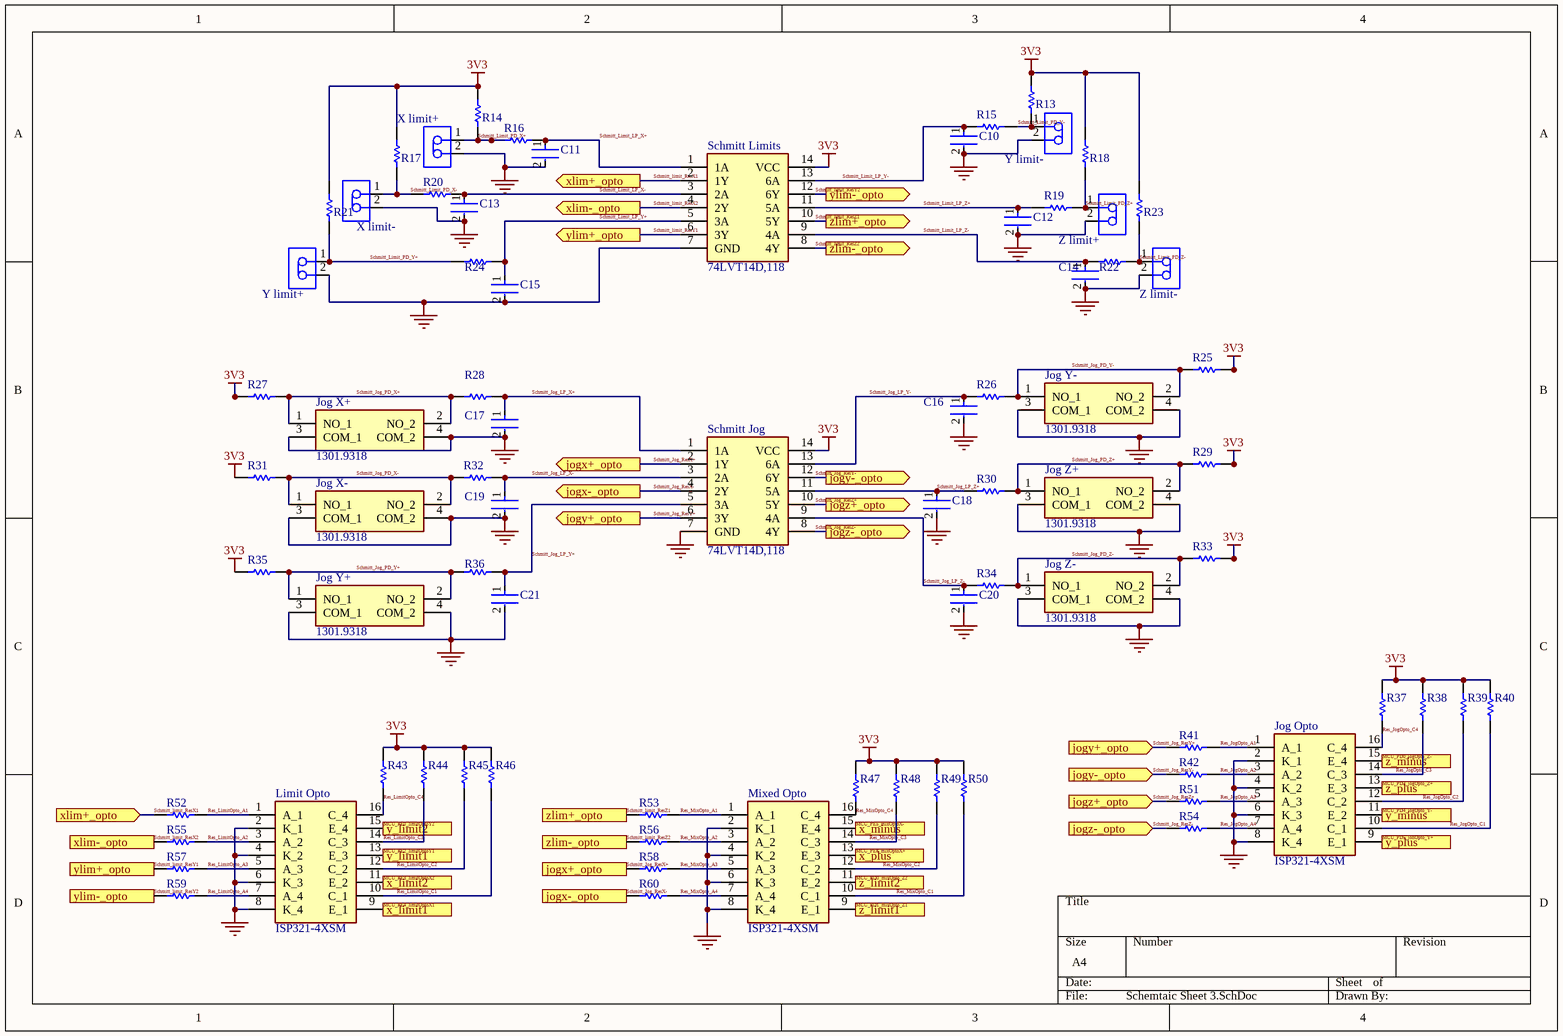
[diagram p2: Schemtaic Sheet 3.SchDoc]

### Parts
C10  K104K15X7RF5TH5  [FP-K15H5-MFG]  (value not drawn)
C11  K104K15X7RF5TH5  [FP-K15H5-MFG]  (value not drawn)
C12  K104K15X7RF5TH5  [FP-K15H5-MFG]  (value not drawn)
C13  K104K15X7RF5TH5  [FP-K15H5-MFG]  (value not drawn)
C14  K104K15X7RF5TH5  [FP-K15H5-MFG]  (value not drawn)
C15  K104K15X7RF5TH5  [FP-K15H5-MFG]  (value not drawn)
C16  K104K15X7RF5TH5  [FP-K15H5-MFG]  (value not drawn)
C17  K104K15X7RF5TH5  [FP-K15H5-MFG]  (value not drawn)
C18  K104K15X7RF5TH5  [FP-K15H5-MFG]  (value not drawn)
C19  K104K15X7RF5TH5  [FP-K15H5-MFG]  (value not drawn)
C20  K104K15X7RF5TH5  [FP-K15H5-MFG]  (value not drawn)
C21  K104K15X7RF5TH5  [FP-K15H5-MFG]  (value not drawn)
Jog_Opto  ISP321-4XSM  [SOP254P1016X460-16N]
Jog_X+  1301.9318  [13019318]
Jog_X-  1301.9318  [Model Name]
Jog_Y+  1301.9318  [13019318]
Jog_Y-  1301.9318  [13019318]
Jog_Z+  1301.9318  [13019318]
Jog_Z-  1301.9318  [13019318]
Limit_Opto  ISP321-4XSM  [SOP254P1016X460-16N]
Mixed_Opto  ISP321-4XSM  [SOP254P1016X460-16N]
R13  MFR-25FBF5210K  [RESA60-630X240]  (value not drawn)
R14  MFR-25FBF5210K  [RESA60-630X240]  (value not drawn)
R15  MFR-25FBF52-1K  [RESA60-630X240]  (value not drawn)
R16  MFR-25FBF52-1K  [RESA60-630X240]  (value not drawn)
R17  MFR-25FBF5210K  [RESA60-630X240]  (value not drawn)
R18  MFR-25FBF5210K  [RESA60-630X240]  (value not drawn)
R19  MFR-25FBF52-1K  [RESA60-630X240]  (value not drawn)
R20  MFR-25FBF52-1K  [RESA60-630X240]  (value not drawn)
R21  MFR-25FBF5210K  [RESA60-630X240]  (value not drawn)
R22  MFR-25FBF52-1K  [RESA60-630X240]  (value not drawn)
R23  MFR-25FBF5210K  [RESA60-630X240]  (value not drawn)
R24  MFR-25FBF52-1K  [RESA60-630X240]  (value not drawn)
R25  MFR-25FBF5210K  [RESA60-630X240]  (value not drawn)
R26  MFR-25FBF52-1K  [RESA60-630X240]  (value not drawn)
R27  MFR-25FBF5210K  [RESA60-630X240]  (value not drawn)
R28  MFR-25FBF52-1K  [RESA60-630X240]  (value not drawn)
R29  MFR-25FBF5210K  [RESA60-630X240]  (value not drawn)
R30  MFR-25FBF52-1K  [RESA60-630X240]  (value not drawn)
R31  MFR-25FBF5210K  [RESA60-630X240]  (value not drawn)
R32  MFR-25FBF52-1K  [RESA60-630X240]  (value not drawn)
R33  MFR-25FBF5210K  [RESA60-630X240]  (value not drawn)
R34  MFR-25FBF52-1K  [RESA60-630X240]  (value not drawn)
R35  MFR-25FBF5210K  [RESA60-630X240]  (value not drawn)
R36  MFR-25FBF52-1K  [RESA60-630X240]  (value not drawn)
R37  MFR-25FBF52-1K  [RESA60-630X240]  (value not drawn)
R38  MFR-25FBF52-1K  [RESA60-630X240]  (value not drawn)
R39  MFR-25FBF52-1K  [RESA60-630X240]  (value not drawn)
R40  MFR-25FBF52-1K  [RESA60-630X240]  (value not drawn)
R41  MFR-25FBF52-1K  [RESA60-630X240]  (value not drawn)
R42  MFR-25FBF52-1K  [RESA60-630X240]  (value not drawn)
R43  MFR-25FBF52-1K  [RESA60-630X240]  (value not drawn)
R44  MFR-25FBF52-1K  [RESA60-630X240]  (value not drawn)
R45  MFR-25FBF52-1K  [RESA60-630X240]  (value not drawn)
R46  MFR-25FBF52-1K  [RESA60-630X240]  (value not drawn)
R47  MFR-25FBF52-1K  [RESA60-630X240]  (value not drawn)
R48  MFR-25FBF52-1K  [RESA60-630X240]  (value not drawn)
R49  MFR-25FBF52-1K  [RESA60-630X240]  (value not drawn)
R50  MFR-25FBF52-1K  [RESA60-630X240]  (value not drawn)
R51  MFR-25FBF52-1K  [RESA60-630X240]  (value not drawn)
R52  MFR-25FBF52-1K  [RESA60-630X240]  (value not drawn)
R53  MFR-25FBF52-1K  [RESA60-630X240]  (value not drawn)
R54  MFR-25FBF52-1K  [RESA60-630X240]  (value not drawn)
R55  MFR-25FBF52-1K  [RESA60-630X240]  (value not drawn)
R56  MFR-25FBF52-1K  [RESA60-630X240]  (value not drawn)
R57  MFR-25FBF52-1K  [RESA60-630X240]  (value not drawn)
R58  MFR-25FBF52-1K  [RESA60-630X240]  (value not drawn)
R59  MFR-25FBF52-1K  [RESA60-630X240]  (value not drawn)
R60  MFR-25FBF52-1K  [RESA60-630X240]  (value not drawn)
Schmitt_Jog  74LVT14D,118  [SOIC127P600X175-14N]
Schmitt_Limits  74LVT14D,118  [SOIC127P600X175-14N]
X_limit+  B2B-PH-K-S(LF)(SN)  [JST-B2B-PH-K-S_V]  (value not drawn)
X_limit-  B2B-PH-K-S(LF)(SN)  [JST-B2B-PH-K-S_V]  (value not drawn)
Y_limit+  B2B-PH-K-S(LF)(SN)  [JST-B2B-PH-K-S_V]  (value not drawn)
Y_limit-  B2B-PH-K-S(LF)(SN)  [JST-B2B-PH-K-S_V]  (value not drawn)
Z_limit+  B2B-PH-K-S(LF)(SN)  [JST-B2B-PH-K-S_V]  (value not drawn)
Z_limit-  B2B-PH-K-S(LF)(SN)  [JST-B2B-PH-K-S_V]  (value not drawn)

### Ports
jogx+_opto (in, see Schemtaic Sheet 3[2B]), jogx+_opto (out, see Schemtaic Sheet 3[2D]), jogx-_opto (in, see Schemtaic Sheet 3[2B]), jogx-_opto (out, see Schemtaic Sheet 3[2D]), jogy+_opto (in, see Schemtaic Sheet 3[2C]), jogy+_opto (out, see Schemtaic Sheet 3[3C]), jogy-_opto (in, see Schemtaic Sheet 3[3B]), jogy-_opto (out, see Schemtaic Sheet 3[3D]), jogz+_opto (in, see Schemtaic Sheet 3[3B]), jogz+_opto (out, see Schemtaic Sheet 3[3D]), jogz-_opto (in, see Schemtaic Sheet 3[3C]), jogz-_opto (out, see Schemtaic Sheet 3[3D]), x_limit1 (out, see Schemtaic Sheet 2[3D]), x_limit2 (out, see Schemtaic Sheet 2[3C]), x_minus (out, see Schemtaic Sheet 2[2D]), x_plus (out, see Schemtaic Sheet 2[2C]), xlim+_opto (in, see Schemtaic Sheet 3[2A]), xlim+_opto (out, see Schemtaic Sheet 3[1D]), xlim-_opto (in, see Schemtaic Sheet 3[2A]), xlim-_opto (out, see Schemtaic Sheet 3[1D]), y_limit1 (out, see Schemtaic Sheet 2[3C]), y_limit2 (out, see Schemtaic Sheet 2[3C]), y_minus (out, see Schemtaic Sheet 2[3C]), y_plus (out, see Schemtaic Sheet 2[3B]), ylim+_opto (in, see Schemtaic Sheet 3[2A]), ylim+_opto (out, see Schemtaic Sheet 3[1D]), ylim-_opto (in, see Schemtaic Sheet 3[3A]), ylim-_opto (out, see Schemtaic Sheet 3[1D]), z_limit1 (out, see Schemtaic Sheet 2[3C]), z_limit2 (out, see Schemtaic Sheet 2[3C]), z_minus (out, see Schemtaic Sheet 2[3B]), z_plus (out, see Schemtaic Sheet 2[3C]), zlim+_opto (in, see Schemtaic Sheet 3[3A]), zlim+_opto (out, see Schemtaic Sheet 3[2D]), zlim-_opto (in, see Schemtaic Sheet 3[3A]), zlim-_opto (out, see Schemtaic Sheet 3[2D])

### Nets
3V3: R13.2 R14.2 R17.2 R18.2 R21.2 R23.2 R25.2 R27.1 R29.2 R31.1 R33.2 R35.1 R37.2 R38.2 R39.2 R40.2 R43.2 R44.2 R45.2 R46.2 R47.2 R48.2 R49.2 R50.2 Schmitt_Jog.14(VCC) Schmitt_Limits.14(VCC)
GND: C10.2 C11.2 C12.2 C13.2 C14.2 C15.2 C16.2 C17.2 C18.2 C19.2 C20.2 C21.2 Jog_Opto.2(K_1) Jog_Opto.4(K_2) Jog_Opto.6(K_3) Jog_Opto.8(K_4) Jog_X+.3(COM_1) Jog_X+.4(COM_2) Jog_X-.3(COM_1) Jog_X-.4(COM_2) Jog_Y+.3(COM_1) Jog_Y+.4(COM_2) Jog_Y-.3(COM_1) Jog_Y-.4(COM_2) Jog_Z+.3(COM_1) Jog_Z+.4(COM_2) Jog_Z-.3(COM_1) Jog_Z-.4(COM_2) Limit_Opto.2(K_1) Limit_Opto.4(K_2) Limit_Opto.6(K_3) Limit_Opto.8(K_4) Mixed_Opto.2(K_1) Mixed_Opto.4(K_2) Mixed_Opto.6(K_3) Mixed_Opto.8(K_4) Schmitt_Jog.7(GND) Schmitt_Limits.7(GND) X_limit+.2 X_limit-.2 Y_limit+.2 Y_limit-.2 Z_limit+.2 Z_limit-.2
MCU_PD0_jogOpto_Z-: Jog_Opto.15(E_4) ; port z_minus
MCU_PD0_mixOpto_Z2: Mixed_Opto.11(E_2) ; port z_limit2
MCU_PD1_mixOpto_Z1: Mixed_Opto.9(E_1) ; port z_limit1
MCU_PD3_jogOpto_Z+: Jog_Opto.13(E_3) ; port z_plus
MCU_PD4_jogOpto_Y-: Jog_Opto.11(E_2) ; port y_minus  [project net MCU_PD3_jogOpto_Y-]
MCU_PD5_johOpto_Y+: Jog_Opto.9(E_1) ; port y_plus  [project net MCU_PD0_jogOpto_Y+]
MCU_PE0_limitOptoY2: Limit_Opto.15(E_4) ; port y_limit2
MCU_PE2_limitOptoY1: Limit_Opto.13(E_3) ; port y_limit1
MCU_PE3_limitOptoX2: Limit_Opto.11(E_2) ; port x_limit2  [project net MCU_PE2_limitOptoX2]
MCU_PE4_limitOptoX1: Limit_Opto.9(E_1) ; port x_limit1  [project net MCU_PE0_limitOptoX1]
MCU_PE5_mixOptoX-: Mixed_Opto.15(E_4) ; port x_minus  [project net MCU_PD1_mixOpto_X-]
MCU_PE8_mixOptoX+: Mixed_Opto.13(E_3) ; port x_plus  [project net MCU_PD0_mixOpto_X+]
Res_JogOpto_A1: Jog_Opto.1(A_1) R41.2
Res_JogOpto_A2: Jog_Opto.3(A_2) R42.2
Res_JogOpto_A3: Jog_Opto.5(A_3) R51.2
Res_JogOpto_A4: Jog_Opto.7(A_4) R54.2
Res_JogOpto_C1: Jog_Opto.10(C_1) R40.1
Res_JogOpto_C2: Jog_Opto.12(C_2) R39.1
Res_JogOpto_C3: Jog_Opto.14(C_3) R38.1
Res_JogOpto_C4: Jog_Opto.16(C_4) R37.1
Res_LimitOpto_A1: Limit_Opto.1(A_1) R52.2
Res_LimitOpto_A2: Limit_Opto.3(A_2) R55.2
Res_LimitOpto_A3: Limit_Opto.5(A_3) R57.2
Res_LimitOpto_A4: Limit_Opto.7(A_4) R59.2
Res_LimitOpto_C1: Limit_Opto.10(C_1) R46.1
Res_LimitOpto_C2: Limit_Opto.12(C_2) R45.1
Res_LimitOpto_C3: Limit_Opto.14(C_3) R44.1
Res_LimitOpto_C4: Limit_Opto.16(C_4) R43.1
Res_MixOpto_A1: Mixed_Opto.1(A_1) R53.2
Res_MixOpto_A2: Mixed_Opto.3(A_2) R56.2
Res_MixOpto_A3: Mixed_Opto.5(A_3) R58.2
Res_MixOpto_A4: Mixed_Opto.7(A_4) R60.2
Res_MixOpto_C1: Mixed_Opto.10(C_1) R50.1
Res_MixOpto_C2: Mixed_Opto.12(C_2) R49.1
Res_MixOpto_C3: Mixed_Opto.14(C_3) R48.1
Res_MixOpto_C4: Mixed_Opto.16(C_4) R47.1
Schmitt_Jog_LP_X+: C17.1 R28.2 Schmitt_Jog.1(1A)
Schmitt_Jog_LP_X-: C19.1 R32.2 Schmitt_Jog.3(2A)
Schmitt_Jog_LP_Y+: C21.1 R36.2 Schmitt_Jog.5(3A)
Schmitt_Jog_LP_Y-: C16.1 R26.1 Schmitt_Jog.13(6A)
Schmitt_Jog_LP_Z+: C18.1 R30.1 Schmitt_Jog.11(5A)
Schmitt_Jog_LP_Z-: C20.1 R34.1 Schmitt_Jog.9(4A)
Schmitt_Jog_PD_X+: Jog_X+.1(NO_1) Jog_X+.2(NO_2) R27.2 R28.1
Schmitt_Jog_PD_X-: Jog_X-.1(NO_1) Jog_X-.2(NO_2) R31.2 R32.1
Schmitt_Jog_PD_Y+: Jog_Y+.1(NO_1) Jog_Y+.2(NO_2) R35.2 R36.1
Schmitt_Jog_PD_Y-: Jog_Y-.1(NO_1) Jog_Y-.2(NO_2) R25.1 R26.2
Schmitt_Jog_PD_Z+: Jog_Z+.1(NO_1) Jog_Z+.2(NO_2) R29.1 R30.2
Schmitt_Jog_PD_Z-: Jog_Z-.1(NO_1) Jog_Z-.2(NO_2) R33.1 R34.2
Schmitt_Jog_ResX+: R58.1 Schmitt_Jog.2(1Y) ; port jogx+_opto
Schmitt_Jog_ResX-: R60.1 Schmitt_Jog.4(2Y) ; port jogx-_opto
Schmitt_Jog_ResY+: R41.1 Schmitt_Jog.6(3Y) ; port jogy+_opto
Schmitt_Jog_ResY-: R42.1 Schmitt_Jog.12(6Y) ; port jogy-_opto
Schmitt_Jog_ResZ+: R51.1 Schmitt_Jog.10(5Y) ; port jogz+_opto
Schmitt_Jog_ResZ-: R54.1 Schmitt_Jog.8(4Y) ; port jogz-_opto
Schmitt_Limit_LP_X+: C11.1 R16.2 Schmitt_Limits.1(1A)
Schmitt_Limit_LP_X-: C13.1 R20.2 Schmitt_Limits.3(2A)
Schmitt_Limit_LP_Y+: C15.1 R24.2 Schmitt_Limits.5(3A)
Schmitt_Limit_LP_Y-: C10.1 R15.1 Schmitt_Limits.13(6A)
Schmitt_Limit_LP_Z+: C12.1 R19.1 Schmitt_Limits.11(5A)
Schmitt_Limit_LP_Z-: C14.1 R22.1 Schmitt_Limits.9(4A)
Schmitt_Limit_PD_X+: R14.1 R16.1 X_limit+.1
Schmitt_Limit_PD_X-: R17.1 R20.1 X_limit-.1
Schmitt_Limit_PD_Y+: R21.1 R24.1 Y_limit+.1
Schmitt_Limit_PD_Y-: R13.1 R15.2 Y_limit-.1
Schmitt_Limit_PD_Z+: R18.1 R19.2 Z_limit+.1
Schmitt_Limit_PD_Z-: R22.2 R23.1 Z_limit-.1
Schmitt_limit_ResX1: R52.1 Schmitt_Limits.2(1Y) ; port xlim+_opto
Schmitt_limit_ResX2: R55.1 Schmitt_Limits.4(2Y) ; port xlim-_opto
Schmitt_limit_ResY1: R57.1 Schmitt_Limits.6(3Y) ; port ylim+_opto
Schmitt_limit_ResY2: R59.1 Schmitt_Limits.12(6Y) ; port ylim-_opto
Schmitt_limit_ResZ1: R53.1 Schmitt_Limits.10(5Y) ; port zlim+_opto
Schmitt_limit_ResZ2: R56.1 Schmitt_Limits.8(4Y) ; port zlim-_opto

### Library data of the parts
C10-C21 = CMP-02417-000078-1: as C8 on sheet Schemtaic Sheet 4; Diameter: 500um; Max Operating Temperature: 125°C; Case/Package: Dipped; Dielectric: X7R; Lead Free: Lead Free; Construction: RADIAL; Voltage: 50V; Thickness: 2.6mm; Min Operating Temperature: -55°C; Lead Pitch: 5mm; Height: 4mm; Radiation Hardening: No; Voltage Rating: 50V; Depth: 2.5mm; Voltage Rating (DC): 50V; Package Quantity: 1; Weight: 0.005644oz; Series: K; Mount: Through Hole; Termination: Radial; Height - Seated (Max): 0.257inch; Length: 4mm; Packaging: Tape and Reel; Width: 2.5mm; RoHS Compliant: Yes
Jog_Opto Limit_Opto Mixed_Opto = ISP321-4XSM: Phototransistor; Manufacturer_Name: Isocom; Datasheet Link: http://isocom.com/wp-content/uploads/2017/08/DD93207-ISP321-1-2-4_20_01_17.pdf; Height: 4.6mm; Manufacturer_Part_Number: ISP321-4XSM
Jog_X+ Jog_X- Jog_Y+ Jog_Y- Jog_Z+ Jog_Z- = 1301.9318: as E-Stop on sheet Schemtaic Sheet 4; Manufacturer_Part_Number: 1301.9318; Mouser Part Number: 693-1301.9318; Mouser Price/Stock: https://www.mouser.co.uk/ProductDetail/Schurter/13019318?qs=tGaZrb6HVSaxYojxkk2y5w%3D%3D; Arrow Part Number: *; Arrow Price/Stock: *; Datasheet Link: https://componentsearchengine.com/Datasheets/2/1301.9318.pdf
R13 R14 R17 R18 R21 R23 R25 R27 R29 R31 R33 R35 = CMP-1659-00074-2: as R1 on sheet Schemtaic Sheet 2; Datasheet URL: http://www.yageo.com/documents/recent/Yageo%20LR_MFR_2013.pdf; Packaging: Bulk; RoHSCompliant: True; Mount: ThroughHole; Package Reference: MFR-25; Termination: Axial; Composition: MetalFilm; Number of Terminations: 2; Package Quantity: 200; Mounting Technology: ThroughHole; Length: 0.248inch; Max Operating Temperature: 155degC; Min Operating Temperature: -55degC; Datasheet Version: 04/2013; Lead Free: LeadFree; Manufacturer URL: http://www.yageo.com/; Tolerance: 1%; Power Rating: 250mW; Package Description: 2-Pin Axial Lead, Dia 2.4 mm, Body Length 6.3 mm; Military Standard: Not; Case\/Package: Axial
R15 R16 R19 R20 R22 R24 R26 R28 R30 R32 R34 R36-R60 = CMP-1659-00075-1: as R7 on sheet Schemtaic Sheet 4; ComponentLink2Description: Datasheet; RoHSCompliant: true; PackageReference: MFR-25; Case\Package: Axial; Max Operating Temperature: 155 degC; DatasheetVersion: Apr-13; Tolerance: 1%; ComponentLink1URL: http://www.yageo.com/; Length: 0.248 inch; ComponentLink2URL: http://www.yageo.com/documents/recent/Yageo%20LR_MFR_2013.pdf; Packaging: Bulk; Package Quantity: 200; PackageDescription: 2-Pin Axial Lead, Dia 2.4 mm, Body Length 6.3 mm; Min Operating Temperature: -55 degC; ComponentLink1Description: Manufacturer URL
Schmitt_Jog Schmitt_Limits = 74LVT14D,118: Integrated Circuit; Manufacturer_Name: Nexperia; Datasheet Link: https://assets.nexperia.com/documents/data-sheet/74LVT14.pdf; Height: 1.75mm; Manufacturer_Part_Number: 74LVT14D,118; Mouser Part Number: 771-74LVT14D-T; Mouser Price/Stock: https://www.mouser.co.uk/ProductDetail/Nexperia/74LVT14D118?qs=me8TqzrmIYWhjwZFM6w3Mg%3D%3D; Arrow Part Number: 74LVT14D,118; Arrow Price/Stock: https://www.arrow.com/en/products/74lvt14d118/nexperia?region=nac
X_limit+ X_limit- Y_limit+ Y_limit- Z_limit+ Z_limit- = CMP-2000-05162-1: as Probe on sheet Schemtaic Sheet 4; Datasheet Version: Nov-08; Datasheet URL: http://datasheet.octopart.com/B2B-PH-K-S%28LF%29%28SN%29-JST-datasheet-8324864.pdf; Manufacturer URL: http://www.jst.com/home2.html; Type: ShroudedHeader; Termination: Crimp

## Nets that join several sheets
3V3: Schemtaic Sheet 2 (R1.2 R5.2 SD_Card.4), Schemtaic Sheet 4 (16 pins), Schemtaic Sheet 3 (26 pins)
5V: Schemtaic Sheet 2 (Coolant.1 R2.1 R3.2), Schemtaic Sheet 4 (C9.1 L298N.9)
GND: Schemtaic Sheet 2 (14 pins), Schemtaic Sheet 4 (29 pins), Schemtaic Sheet 3 (44 pins)
MCU_PA0_SpindleEN: Schemtaic Sheet 2 (CN10.PA0), Schemtaic Sheet 4 (L298N.6)
MCU_PA3_L298_IN2: Schemtaic Sheet 2 (CN9.PA3), Schemtaic Sheet 4 (L298N.7)
MCU_PA4_L298_IN1: Schemtaic Sheet 2 (CN7.PA4), Schemtaic Sheet 4 (L298N.5)
MCU_PB3_Y-Dir: Schemtaic Sheet 2 (CN7.PB3), Schemtaic Sheet 4 (Y-axis.8)
MCU_PB4_X-Dir: Schemtaic Sheet 2 (CN7.PB4), Schemtaic Sheet 4 (X-axis.8)
MCU_PB5_Z-Step: Schemtaic Sheet 2 (CN7.PB5), Schemtaic Sheet 4 (Z-axis.7)
MCU_PB6_Z-Dir: Schemtaic Sheet 2 (CN10.PB6), Schemtaic Sheet 4 (Z-axis.8)
MCU_PB8_Y-Step: Schemtaic Sheet 2 (CN7.PB8), Schemtaic Sheet 4 (Y-axis.7)
MCU_PB9_Res_stepperEN: Schemtaic Sheet 2 (CN7.PB9 R1.1), Schemtaic Sheet 4 (X-axis.1 Y-axis.1 Z-axis.1)
MCU_PB15_X-Step: Schemtaic Sheet 2 (CN7.PB15), Schemtaic Sheet 4 (X-axis.7)
MCU_PD0_jogOpto_Y+: Schemtaic Sheet 2 (CN8.PD2), Schemtaic Sheet 3 (Jog_Opto.9)
MCU_PD0_jogOpto_Z-: Schemtaic Sheet 2 (CN9.PD5), Schemtaic Sheet 3 (Jog_Opto.15)
MCU_PD0_mixOpto_X+: Schemtaic Sheet 2 (CN9.PD0), Schemtaic Sheet 3 (Mixed_Opto.13)
MCU_PD0_mixOpto_Z2: Schemtaic Sheet 2 (CN9.PE6), Schemtaic Sheet 3 (Mixed_Opto.11)
MCU_PD1_mixOpto_X-: Schemtaic Sheet 2 (CN9.PD1), Schemtaic Sheet 3 (Mixed_Opto.15)
MCU_PD1_mixOpto_Z1: Schemtaic Sheet 2 (CN9.PE5), Schemtaic Sheet 3 (Mixed_Opto.9)
MCU_PD3_jogOpto_Y-: Schemtaic Sheet 2 (CN9.PD3), Schemtaic Sheet 3 (Jog_Opto.11)
MCU_PD3_jogOpto_Z+: Schemtaic Sheet 2 (CN9.PD4), Schemtaic Sheet 3 (Jog_Opto.13)
MCU_PE0_limitOptoX1: Schemtaic Sheet 2 (CN10.PE0), Schemtaic Sheet 3 (Limit_Opto.9)
MCU_PE0_limitOptoY2: Schemtaic Sheet 2 (CN9.PE4), Schemtaic Sheet 3 (Limit_Opto.15)
MCU_PE2_limitOptoX2: Schemtaic Sheet 2 (CN10.PE2), Schemtaic Sheet 3 (Limit_Opto.11)
MCU_PE2_limitOptoY1: Schemtaic Sheet 2 (CN9.PE3), Schemtaic Sheet 3 (Limit_Opto.13)
MCU_PF0_holdR: Schemtaic Sheet 2 (CN9.PF0), Schemtaic Sheet 4 (R9.1)
MCU_Pf1_stopR: Schemtaic Sheet 2 (CN9.PF1), Schemtaic Sheet 4 (R7.1)
MCU_PF2_SDoor_R11: Schemtaic Sheet 2 (CN9.PF2), Schemtaic Sheet 4 (R11.1)
MCU_PF7_ProbeR: Schemtaic Sheet 2 (CN9.PF7), Schemtaic Sheet 4 (Probe.1)